# Altium schematic sheet Interface.SchDoc: Bluetooth Gateway
size A; CheckedBy: QUOCTHANG; DrawnBy: DONGKHOA; Revision: V1.0.0; SheetNumber: 10; SheetTotal: 10
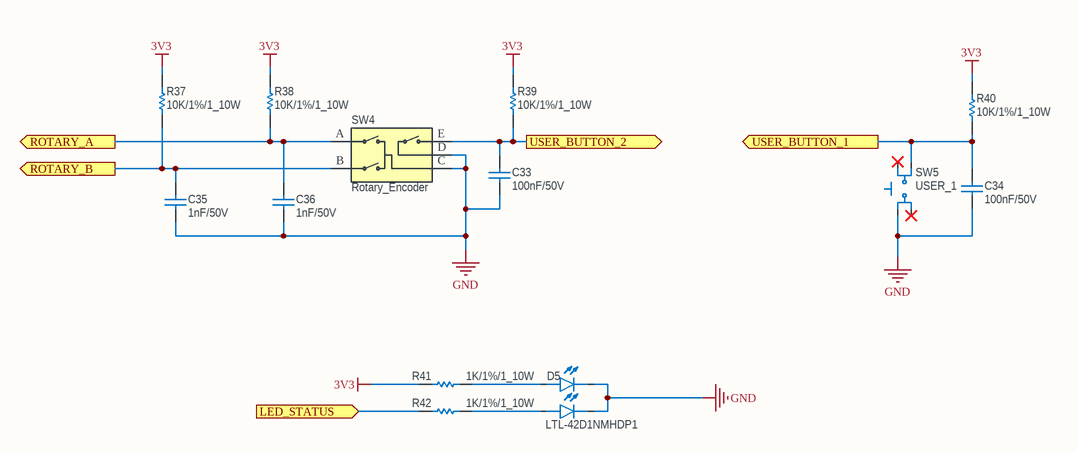
[diagram p0: Interface.SchDoc]

## Parts
C33  100nF/50V  [CAP_0603]
C34  100nF/50V  [CAP_0603]
C35  1nF/50V  [CAP_0603]
C36  1nF/50V  [CAP_0603]
D5  LTL-42D1NMHDP1  [LTL42D1NMHDP1]
R37  10K/1%/1_10W  [Resistor_0603]
R38  10K/1%/1_10W  [Resistor_0603]
R39  10K/1%/1_10W  [Resistor_0603]
R40  10K/1%/1_10W  [Resistor_0603]
R41  1K/1%/1_10W  [Resistor_0603]
R42  1K/1%/1_10W  [Resistor_0603]
SW4  Rotary_Encoder  [EC11E_AAL]
SW5  USER_1  [SW_B3F-4050_OMR]

## Ports
LED_STATUS (in, see Overview_Schematic[4C], MCU[2B]), ROTARY_A (out, see Overview_Schematic[4C], MCU[2A]), ROTARY_B (out, see Overview_Schematic[4C], MCU[2B]), USER_BUTTON_1 (out, see Overview_Schematic[4C], MCU[2A]), USER_BUTTON_2 (out, see Overview_Schematic[4C], MCU[2A])

## Nets
3V3: R37.2 R38.2 R39.2 R40.2 R41.1
GND: C33.1 C34.1 C35.1 C36.1 D5.1(K_1) D5.3(K_2) SW4.C SW4.D SW5.3
LED_STATUS: R42.1 ; port LED_STATUS
ROTARY_A: C36.2 R38.1 SW4.A ; port ROTARY_A
ROTARY_B: C35.2 R37.1 SW4.B ; port ROTARY_B
USER_BUTTON_1: C34.2 R40.1 SW5.2 ; port USER_BUTTON_1
USER_BUTTON_2: C33.2 R39.1 SW4.E ; port USER_BUTTON_2
NetD5_2: D5.2(A_1) R41.2
NetD5_4: D5.4(A_2) R42.2

Not connected (* = marked no-connect by the designer): SW5 1* 4*

## Notes on the sheet
- Project Name
- Size
- A4
- Revision
- Checked By:
- Drawn By:
- Date:
- File:
- Last Modified:
- Sheet
- of

## Library data of the parts
C33 C34 = Ceramic_Cap_100nF_50V_0603: CAP, size 0603, 100nF, 50V; Supply Part Number: Tụ Gốm 0603 100nF (0.1uF) 50V; Supply Name: Thegioiic; Datasheet: *; Supply URL: https://www.thegioiic.com/tu-gom-0603-100nf-0-1uf-50v
C35 C36 = Ceramic_Cap_1nF_50V_0603: CAP, size 0603, 1nF, 50V; Supply Part Number: CC0603KRX7R9BB102; Supply Name: tme; Datasheet: *; Supply URL: http://tme.vn/Product.aspx?id=1218#page=pro_info
D5 = LTL-42D1NMHDP1: 2 LED 3mm, xuyên lỗ; Supply Part Number: Bộ Chỉ Thị 2 LED Xanh lá-Đỏ 3mm Đế Nhựa Hàn PCB; Supply Name: Thegioiic; Supply URL: https://www.thegioiic.com/bo-chi-thi-2-led-xanh-la-do-3mm-de-nhua-han-pcb
R37-R40 = Res_10K_0603_1%: Resistor 0603 10KOhm 1% 1_10W; Supply Part Number: Điện Trở 10 KOhm 0603 1%; Supply Name: Thegioiic; Supply URL: https://www.thegioiic.com/dien-tro-10-kohm-0603-1-
R41 R42 = Res_1K_0603_1%: Resistor 0603 1KOhm 1% 1_10W; Supply Part Number: Điện Trở 1 KOhm 0603 1%; Supply Name: Thegioiic; Supply URL: https://www.thegioiic.com/dien-tro-1-kohm-0603-1-
SW4 = Rotary_Encoder: No Description Available; Supply Part Number: EC11 Rotary Encoder 20 Vị Trí 15mm; Supply Name: Thegioiic; Datasheet: https://www.mouser.com/datasheet/2/15/EC11-1370808.pdf?srsltid=AfmBOorL-p3RDg0TVWdiqS1ahAZMuYN-p-HqCGniHXWN9SXXGVQbWXfM; Supply URL: https://www.thegioiic.com/ec11-rotary-encoder-20-vi-tri-15mm
SW5 = Button_B3F-4055: No Description Available; Supply Part Number: B3F-4055 Nút Nhấn 12x12mm Cao 7.3mm 4 Chân Xuyên Lỗ Omron; Supply Name: Thegioiic; Datasheet: *; Supply URL: https://www.thegioiic.com/b3f-4055-nut-nhan-12x12mm-cao-7-3mm-4-chan-xuyen-lo-omron